# EAGLE design ccc_badge (EAGLE 5.10)
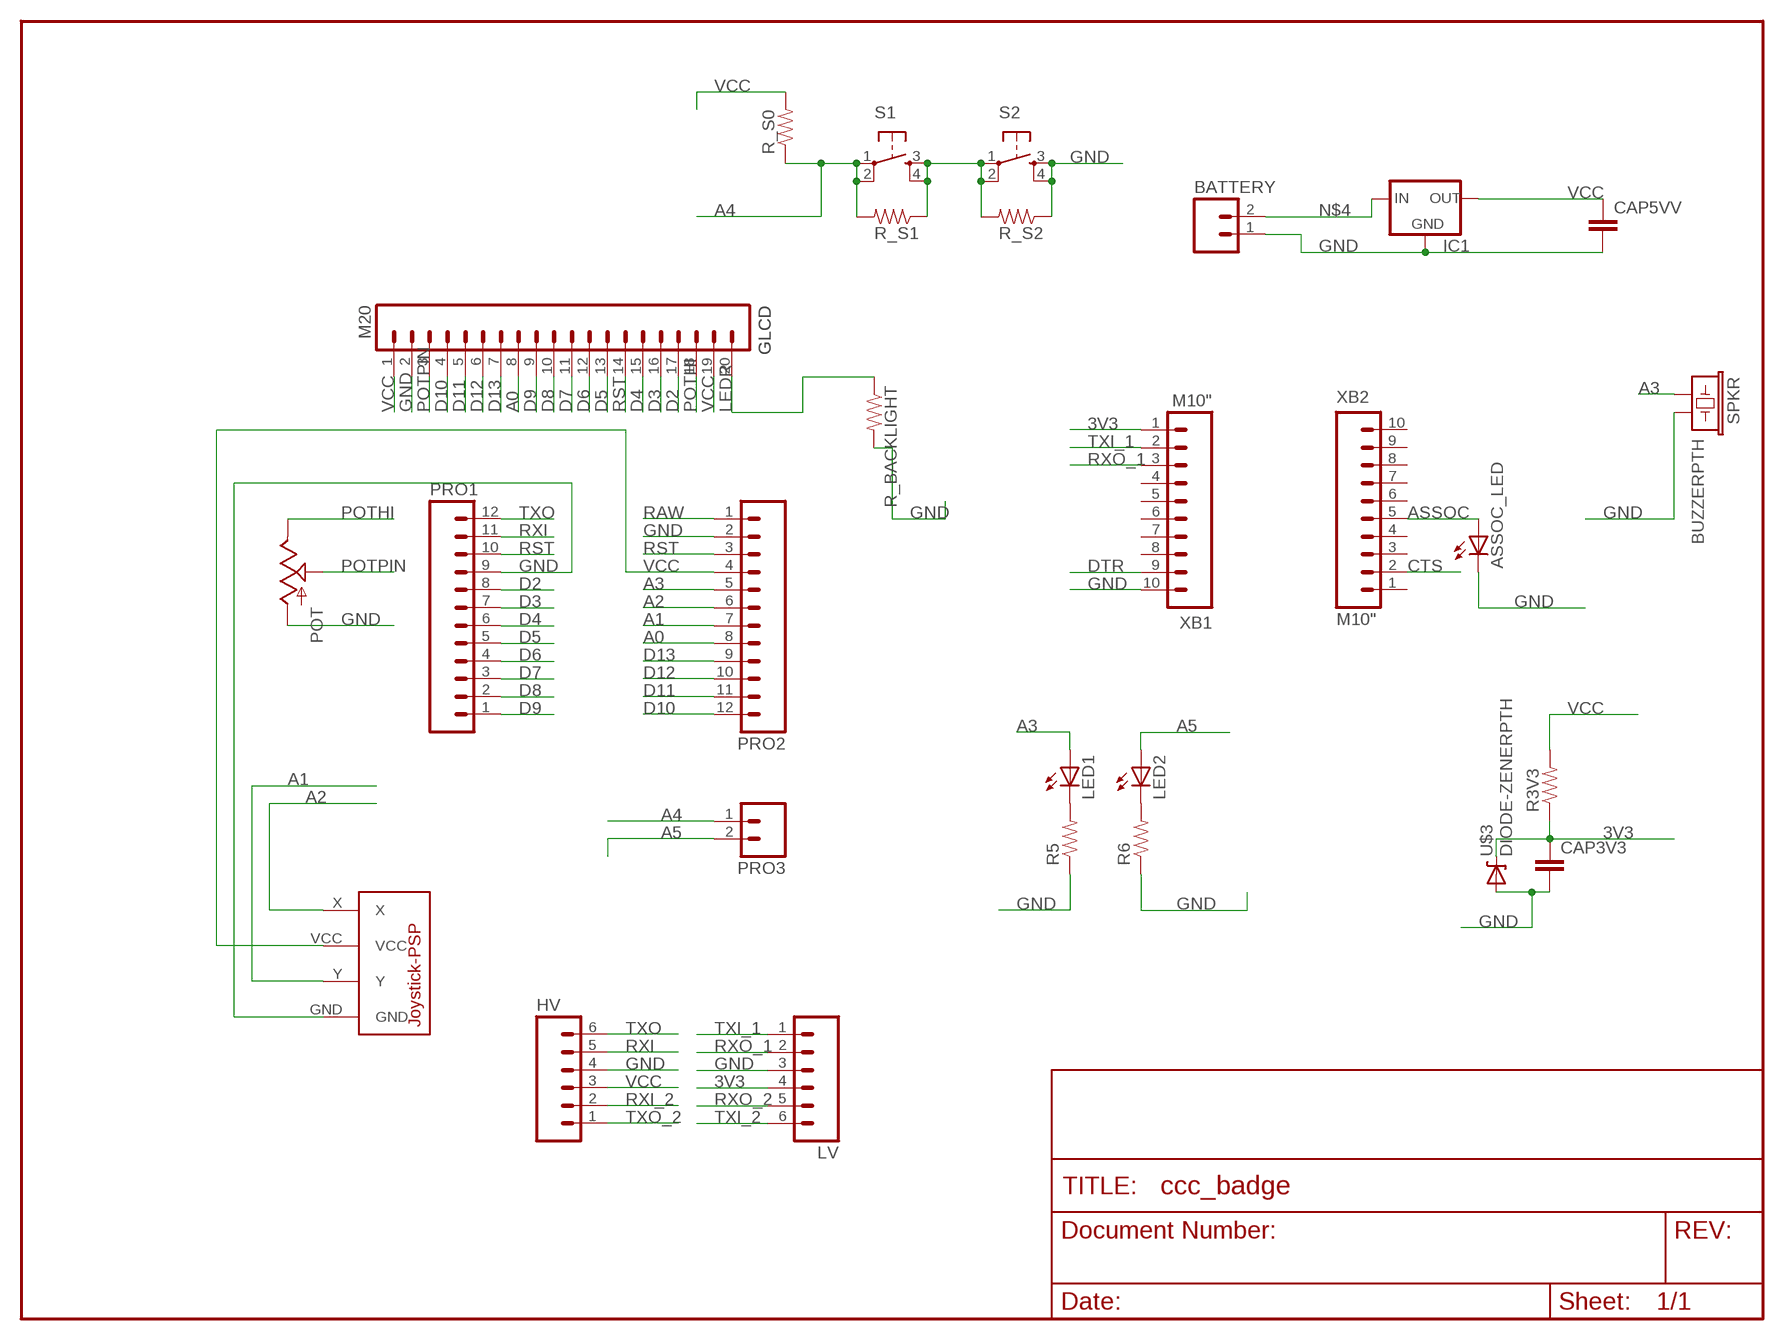
[diagram p0: schematic, sheet 1]

## Parts
ASSOC_LED  LED5MM  [LED5MM]
BATTERY  M02POLAR_LOCK  [MOLEX-1X2_LOCK]
CAP3V3  CAP_  [AXIAL-5MM]
CAP5VV  CAP_  [AXIAL-5MM]
GLCD  M20  [1X20]
HV  M06SIP  [1X06]
IC1  V_REG_78XXSIDE  [78XXL]
LED1  LED5MM  [LED5MM]
LED2  LED5MM  [LED5MM]
LV  M06SIP  [1X06]
POT  POT100K_3362U  [3362U]
PRO1  M12PTH  [1X12]
PRO2  M12PTH  [1X12]
PRO3  M02PTH  [1X02]
R3V3  RESISTORPTH1  [AXIAL-0.3]
R5  RESISTORPTH1  [AXIAL-0.3]
R6  RESISTORPTH1  [AXIAL-0.3]
R_BACKLIGHT  RESISTORPTH1  [AXIAL-0.3]
R_S0  RESISTORPTH1  [AXIAL-0.3]
R_S1  RESISTORPTH1  [AXIAL-0.3]
R_S2  RESISTORPTH1  [AXIAL-0.3]
S1  TAC_SWITCHPTH  [TACTILE-PTH]
S2  TAC_SWITCHPTH  [TACTILE-PTH]
SPKR  BUZZERPTH  [BUZZER-12MM]
U$1  JOYSTICK-PSP1000  [JOYSTICK-PSP1000]
U$3  DIODE-ZENERPTH  [DIODE-ZENER]
XB1  M10"  [1X10]
XB2  M10"  [1X10]

## Nets
3V3: CAP3V3.P$1 LV.4 R3V3.P$1 U$3.P$1(C) XB1.1
A0: GLCD.8 PRO2.8
A1: PRO2.7 U$1.Y
A2: PRO2.6 U$1.X
A3: LED1.A PRO2.5 SPKR.+
A4: PRO3.1 R_S0.P$1 R_S1.P$2 S1.1 S1.2
A5: LED2.A PRO3.2
ASSOC: ASSOC_LED.A XB2.5
CTS: XB2.2
D2: GLCD.17 PRO1.8
D3: GLCD.16 PRO1.7
D4: GLCD.15 PRO1.6
D5: GLCD.13 PRO1.5
D6: GLCD.12 PRO1.4
D7: GLCD.11 PRO1.3
D8: GLCD.10 PRO1.2
D9: GLCD.9 PRO1.1
D10: GLCD.4 PRO2.12
D11: GLCD.5 PRO2.11
D12: GLCD.6 PRO2.10
D13: GLCD.7 PRO2.9
DTR: XB1.9
GND [vcc]: ASSOC_LED.K(C) BATTERY.1 CAP3V3.P$2 CAP5VV.P$2 GLCD.2 HV.4 IC1.GND LV.3 POT.P$3(A) PRO1.9 PRO2.2 R5.P$1 R6.P$1 R_BACKLIGHT.P$2 R_S2.P$1 S2.3 S2.4 SPKR.- U$1.GND U$3.P$2(A) XB1.10
LEDR: GLCD.20 R_BACKLIGHT.P$1
N$2: R_S1.P$1 R_S2.P$2 S1.3 S1.4 S2.1 S2.2
N$4: BATTERY.2 IC1.IN
N$5: LED1.K(C) R5.P$2
N$6: LED2.K(C) R6.P$2
POTHI: GLCD.18 POT.P$1(E)
POTPIN: GLCD.3 POT.P$2(S)
RAW [vcc]: PRO2.1
RST: GLCD.14 PRO1.10 PRO2.3
RXI: HV.5 PRO1.11
RXI_2: HV.2
RXO_1: LV.2 XB1.3
RXO_2: LV.5
TXI_1: LV.1 XB1.2
TXI_2: LV.6
TXO: HV.6 PRO1.12
TXO_2: HV.1
VCC: CAP5VV.P$1 GLCD.1 GLCD.19 HV.3 IC1.OUT PRO2.4 R3V3.P$2 R_S0.P$2 U$1.VCC
Unconnected: XB1.4 XB1.5 XB1.6 XB1.7 XB1.8 XB2.1 XB2.3 XB2.4 XB2.6 XB2.7 XB2.8 XB2.9 XB2.10

## Library data of the parts
ASSOC_LED LED1 LED2 = SparkFun:LED: LEDs Standard schematic elements and footprints for 5mm, 3mm, 1206, and 0603 sized LEDs. 5mm - Spark Fun Electronics SKU : COM-00529 (and others)
BATTERY PRO3 = SparkFun:M02: Header 2 Standard 2-pin 0.1" header. Use with straight break away headers (SKU : PRT-00116), right angle break away headers (PRT-00553), swiss pins (PRT-00743), machine pins (PRT-00117), and female headers (PRT-00115). Molex polarized connector foot print use with SKU : PRT-08233 with associated crimp pins and housings.
CAP3V3 CAP5VV = SparkFun:CAP: Capacitor Standard 0603 ceramic capacitor, and 0.1" leaded capacitor.
GLCD = SparkFun:M20: This is just like the LOCK variant in that the holes are staggared by 5 mil, but except for the last two holes. They are not altered from the "standard" footprint layout. This is used for a special purpose on the layout of our Graphic LCD Backpack. Make sure you want to use this device before selecting it for you project!
HV LV = SparkFun:M06: Header 6 Standard 6-pin 0.1" header. Use with straight break away headers (SKU : PRT-00116), right angle break away headers (PRT-00553), swiss pins (PRT-00743), machine pins (PRT-00117), and female headers (PRT-00115). Molex polarized connector foot print use with SKU : PRT-08094 with associated crimp pins and housings. NOTES ON THE VARIANTS LOCK and LOCK_LONGPADS... This footprint was designed to help hold the alignment of a through-hole component (i.e. 6-pin header) while soldering it into place. You may notice that each hole has been shifted either up or down by 0.005 of an inch from it's more standard position (which is a perfectly straight line). This slight alteration caused the pins (the squares in the middle) to touch the edges of the holes. Because they are alternating, it causes a "brace" to hold the component in place. 0.005 has proven to be the perfect amount of "off-center" position when using our standard breakaway headers. Although looks a little odd when you look at the bare footprint, once you have a header in there, the alteration is very hard to notice. Also, if you push a header all the way into place, it is covered up entirely on the bottom side. This idea of altering the position of holes to aid alignment will be further integrated into the Sparkfun Library for other footprints. It can help hold any component with 3 or more connection pins.
IC1 = SparkFun:V_REG_78XX: Voltage Regulator Standard 7805 5V regulator. IGO (Input Ground Output). Spark Fun Electronics SKU : COM-00107
POT = SparkFun:POT
PRO1 PRO2 = SparkFun:M12: Header 12 Standard 12-pin 0.1" header. Use with straight break away headers (SKU : PRT-00116), right angle break away headers (PRT-00553), swiss pins (PRT-00743), machine pins (PRT-00117), and female headers (PRT-00115).
R3V3 R5 R6 R_BACKLIGHT R_S0 R_S1 R_S2 = SparkFun:RESISTOR: Resistor Basic schematic elements and footprints for 0603, 1206, and PTH 1/10th watt (small) resistors.
S1 S2 = SparkFun:TAC_SWITCH: Momentary Switch Button commonly used for reset or general input. Spark Fun Electronics SKU : COM-00097
SPKR = SparkFun:BUZZER: Buzzer 12mm Spark Fun Electronics SKU : Comp-Buzzer
U$1 = SparkFun:JOYSTICK-PSP1000: This is a footprint for the PSP-1000 Joystick. 4-pins: X, Y, Vcc and GND
U$3 = SparkFun:DIODE-ZENER: Zener Diode Production Part - 8199 3.4V Zener Voltage
XB1 XB2 = SparkFun:M10: Header 10 Standard 10-pin 0.1" header. Use with straight break away headers (SKU : PRT-00116), right angle break away headers (PRT-00553), swiss pins (PRT-00743), machine pins (PRT-00117), and female headers (PRT-00115).

## Net classes
0 default: width 0.203 mm
1 vcc: width 0.254 mm

## Board
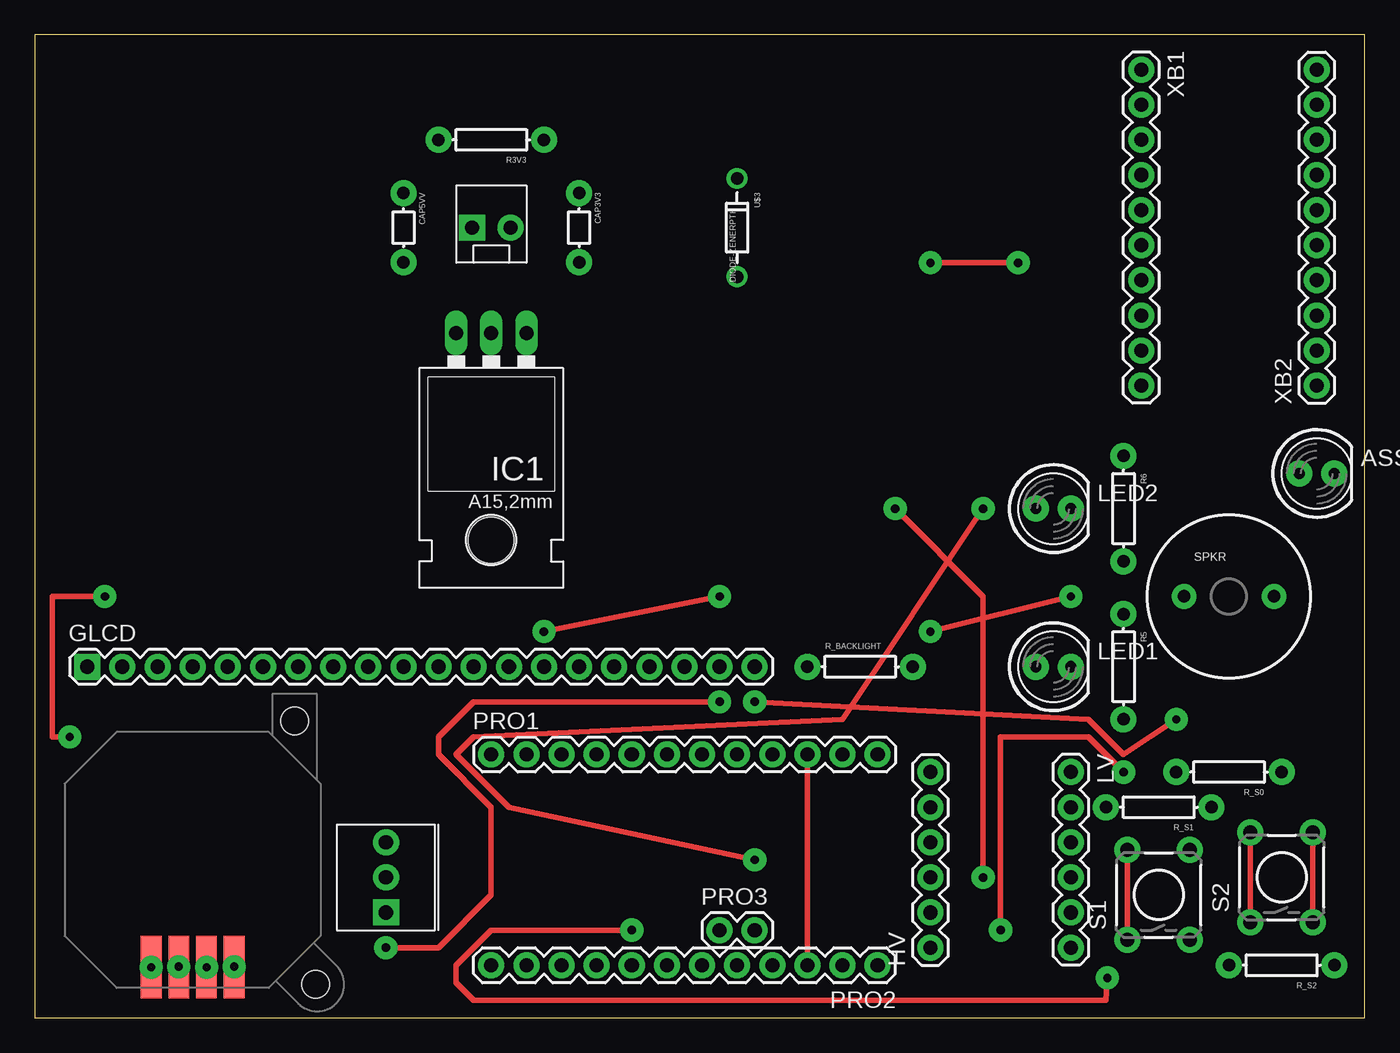
[diagram p1: board, top side]
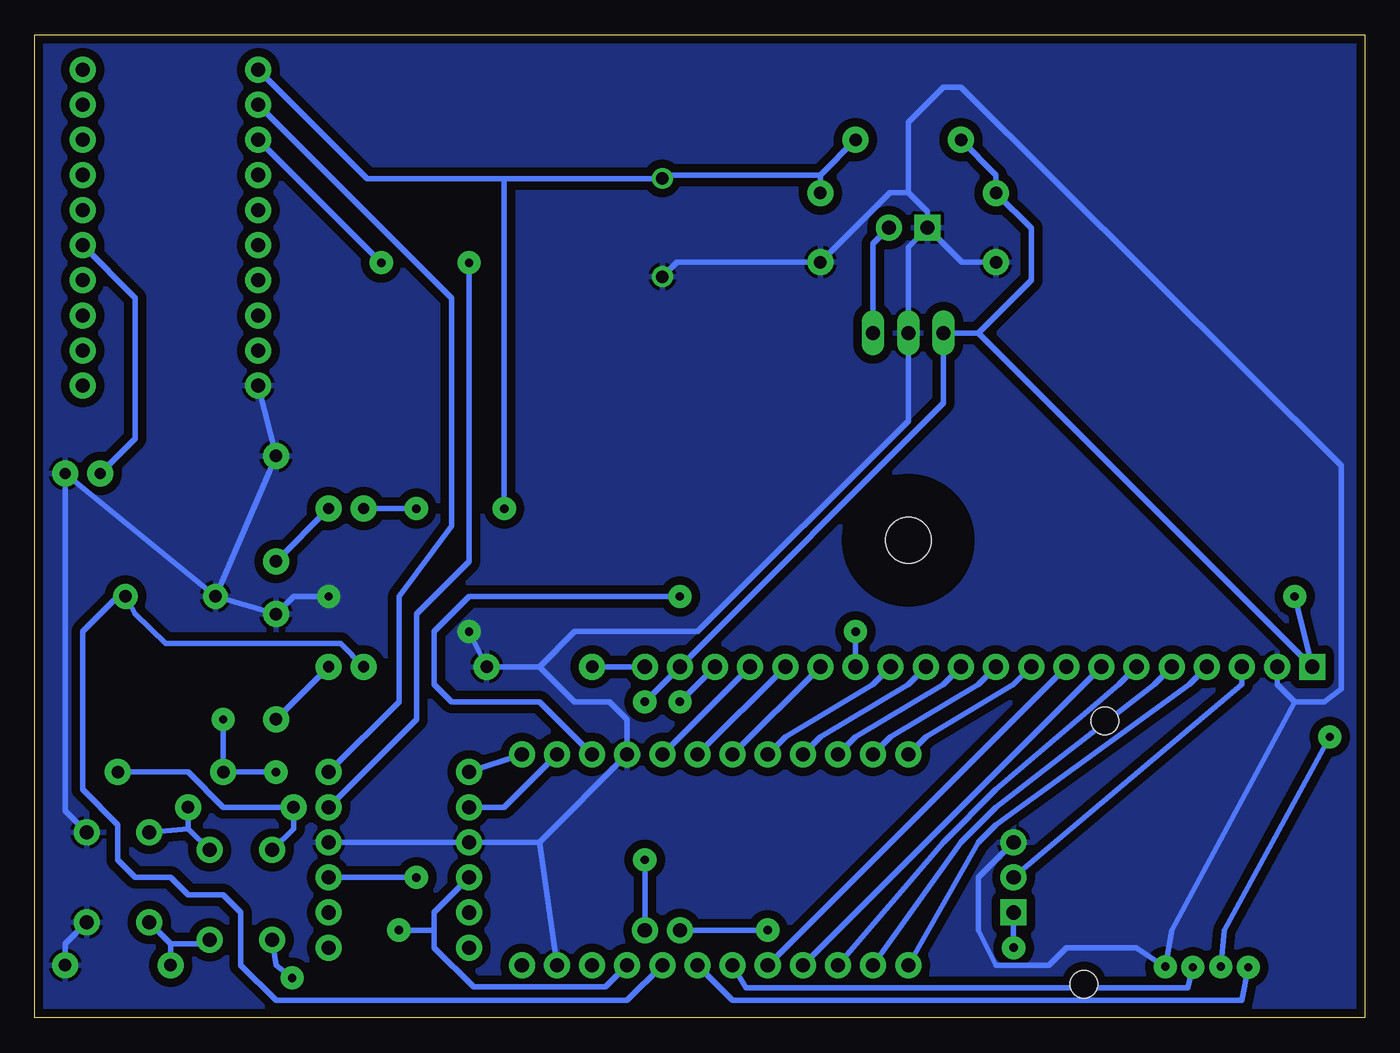
[diagram p2: board, bottom side, seen from below]

Size 96.19 x 71.11 mm. Coordinates in mm from the lower left corner, seen from the top.
Outline: 0,0 96.19,0 96.19,71.11 0,71.11 0,0
Copper layers (1*16): Top 0.035mm / dielectric 1.5mm / Bottom 0.035mm
Design rules "www.sparkfun.com tutorial Eagle-DFM SparkFun": minimum track width 8mil, minimum drill 20mil, track to track 8mil, track to pad 8mil, pad to pad 8mil, via to via 8mil, smd to smd 8mil, copper to edge 10mil, drill to drill 8mil, minimum pad ring 12mil, minimum via ring 10mil, stop-mask expansion 4mil, vias tented up to drill 25mil, thermal gap 10mil

### Footprints (pad centres in the part's own frame; a part is rotated, then mirrored left to right if it is on the bottom)
LED5MM = drill 0.813 pad 1.88 round: A -1.27,0; K 1.27,0
MOLEX-1X2_LOCK = drill 1.016 pad 1.88 square: 1 -0.127,0 | drill 1.016 pad 1.88 round: 2 2.667,0
AXIAL-5MM = drill 0.9 pad 1.88 round: P$1 -2.5,0; P$2 2.5,0
1X20 = drill 1.016 pad 1.88 square: 1 0,0 | drill 1.016 pad 1.88 round: 2 2.54,0; 3 5.08,0; 4 7.62,0; 5 10.16,0; 6 12.7,0; 7 15.24,0; 8 17.78,0; 9 20.32,0; 10 22.86,0; 11 25.4,0; 12 27.94,0; 13 30.48,0; 14 33.02,0; 15 35.56,0; 16 38.1,0; 17 40.64,0; 18 43.18,0; 19 45.72,0; 20 48.26,0
1X06 = drill 1.016 pad 1.88 round: 1 0,0; 2 2.54,0; 3 5.08,0; 4 7.62,0; 5 10.16,0; 6 12.7,0
78XXL = drill 1.016 long: GND 0,-3.81; IN -2.54,-3.81; OUT 2.54,-3.81 | hole 3.302: 0,11.176
3362U = drill 1.016 pad 1.88 square: P$1 0,2.54 | drill 1.016 pad 1.88 round: P$2 2.54,2.54; P$3 5.08,2.54
1X12 = drill 1.016 pad 1.88 round: 1 0,0; 2 2.54,0; 3 5.08,0; 4 7.62,0; 5 10.16,0; 6 12.7,0; 7 15.24,0; 8 17.78,0; 9 20.32,0; 10 22.86,0; 11 25.4,0; 12 27.94,0
1X02 = drill 1.016 pad 1.88 round: 1 0,0; 2 2.54,0
AXIAL-0.3 = drill 0.9 pad 1.88 round: P$1 -3.81,0; P$2 3.81,0
TACTILE-PTH = drill 1.016 pad 1.88 round: 1 -3.251,2.261; 2 3.251,2.261; 3 -3.251,-2.261; 4 3.251,-2.261
BUZZER-12MM = drill 0.9 pad 1.778 round: + 3.25,0; - -3.25,0
JOYSTICK-PSP1000 = smd 1.5 x 4.5: GND -3,7.75; VCC 1,7.75; X 3,7.75; Y -1,7.75 | hole 2: -8.89,8.985; -7.375,-10.06
DIODE-ZENER = drill 0.9 round: P$1 -3.556,0; P$2 3.556,0
1X10 = drill 1.016 pad 1.88 round: 1 0,0; 2 2.54,0; 3 5.08,0; 4 7.62,0; 5 10.16,0; 6 12.7,0; 7 15.24,0; 8 17.78,0; 9 20.32,0; 10 22.86,0

### Placement (x,y rotation side)
ASSOC_LED  92.71,39.37 0 top
BATTERY  31.75,57.15 0 top
CAP3V3  39.37,57.15 270 top
CAP5VV  26.67,57.15 270 top
GLCD  3.81,25.4 0 top
HV  64.77,5.08 90 top
IC1  33.02,45.72 180 top
LED1  73.66,25.4 0 top
LED2  73.66,36.83 0 top
LV  74.93,17.78 270 top
POT  27.94,7.62 90 top
PRO1  33.02,19.05 0 top
PRO2  60.96,3.81 180 top
PRO3  49.53,6.35 0 top
R3V3  33.02,63.5 180 top
R5  78.74,25.4 270 top
R6  78.74,36.83 270 top
R_BACKLIGHT  59.69,25.4 0 top
R_S0  86.36,17.78 180 top
R_S1  81.28,15.24 180 top
R_S2  90.17,3.81 180 top
S1  81.28,8.89 90 top
S2  90.17,10.16 90 top
SPKR  86.36,30.48 0 top
U$1  11.43,11.43 180 top
U$3  50.8,57.15 270 top
XB1  80.01,68.58 270 top
XB2  92.71,45.72 90 top

### Tracks (layer width: path | path; a pad name or v marks a point on that pad's centre or on a via)
3V3  (via drill 0.6 pad 1.68)
  Top 0.406: v68.58,10.16 68.58,30.48 v62.23,36.83
  Bottom 0.406: 39.37,60.96 CAP3V3.P$1 | 39.37,60.96 R3V3.P$1 | 39.37,60.96 50.55,60.96 U$3.P$1 62.23,60.71 | 62.23,60.71 72.14,60.71 XB1.1 | v68.58,10.16 LV.4 | v62.23,36.83 62.23,60.71
A0
  Bottom 0.406: GLCD.8 PRO2.8
A1  (1 unrouted)
  Bottom 0.406: PRO2.7 44.76,2.18 12.8,2.18 U$1.Y
A2  (1 unrouted)
  Bottom 0.406: PRO2.6 45.72,1.27 8.89,1.27 U$1.X
A3
  Bottom 0.406: PRO2.5 53.34,1.27 78.74,1.27 81.28,3.81 81.28,7.62 82.55,8.89 85.09,8.89 86.36,10.16 88.9,10.16 90.17,11.43 90.17,13.97 92.71,16.51 92.71,27.94 90.17,30.48 SPKR.+ 88.9,29.21 86.72,27.08 74.07,27.08 LED1.A
A4  (via drill 0.6 pad 1.68)
  Top 0.406: v43.18,6.35 33.02,6.35 30.48,3.81 30.48,2.54 31.75,1.27 77.47,1.27 v77.57,2.9 | S1.1 S1.2
  Bottom 0.406: S1.2 77.47,13.69 R_S1.P$2 82.55,15.24 85.09,17.78 R_S0.P$1 | v43.18,6.35 PRO3.1 | v77.57,2.9 78.74,3.81 S1.1
A5  (via drill 0.6 pad 1.68)
  Top 0.406: v68.58,36.83 58.42,21.59 31.75,20.32 30.48,19.05 34.29,15.24 v52.07,11.43
  Bottom 0.406: v68.58,36.83 LED2.A | v52.07,11.43 PRO3.2
ASSOC
  Bottom 0.406: ASSOC_LED.A 88.9,41.91 88.9,52.07 XB2.5
D2
  Bottom 0.406: GLCD.17 PRO1.8
D3
  Bottom 0.406: GLCD.16 PRO1.7
D4
  Bottom 0.406: GLCD.15 PRO1.6
D5
  Bottom 0.406: PRO1.5 41.91,20.32 35.56,24.13 GLCD.13
D6
  Bottom 0.406: PRO1.4 39.37,20.32 33.02,24.13 GLCD.12
D7
  Bottom 0.406: PRO1.3 36.83,20.32 30.48,24.13 GLCD.11
D8
  Bottom 0.406: PRO1.2 34.29,20.32 27.94,24.13 GLCD.10
D9
  Bottom 0.406: PRO1.1 31.75,20.32 25.4,24.13 GLCD.9
D10
  Bottom 0.406: PRO2.12 27.94,12.7 26.67,13.97 12.7,24.13 GLCD.4
D11
  Bottom 0.406: PRO2.11 29.21,12.7 26.67,15.24 15.24,24.13 GLCD.5
D12
  Bottom 0.406: PRO2.10 30.48,12.7 26.67,16.51 17.78,24.13 GLCD.6
D13
  Bottom 0.406: GLCD.7 PRO2.9
GND  (via drill 0.6 pad 1.68)  (1 unrouted)
  Top 0.406: v64.77,27.94 v74.93,30.48 | S2.4 S2.3
  Bottom 0.406: CAP5VV.P$2 29.12,54.65 BATTERY.1 | BATTERY.1 33.02,55.75 IC1.GND 33.02,43.18 48.26,27.94 57.15,27.94 59.69,25.4 | BATTERY.1 31.62,58.29 33.02,59.69 | 33.02,59.69 34.33,59.69 CAP3V3.P$2 49.74,54.65 U$3.P$2 | R_S2.P$1 93.98,5.36 S2.3 | GLCD.2 6.35,24.13 5.08,22.86 | 5.08,22.86 2.95,22.86 1.73,23.77 1.73,39.93 29.21,67.31 30.48,67.31 33.02,64.77 33.02,59.69 | POT.P$3 27.94,10.16 27.94,6.35 26.67,3.81 22.86,3.81 21.59,5.08 16.51,5.08 U$1.GND 13.97,6.35 5.08,22.86 | 59.69,25.4 57.15,22.86 54.61,22.86 53.34,21.59 PRO1.9 59.69,12.7 | SPKR.- R5.P$1 77.47,30.48 v74.93,30.48 | SPKR.- R6.P$1 XB1.10 | SPKR.- ASSOC_LED.K 93.98,14.96 S2.4 | 59.69,12.7 HV.4 LV.3 | 59.69,12.7 PRO2.2 | 59.69,25.4 R_BACKLIGHT.P$2 v64.77,27.94
  pour Bottom (isolate 0.61): 0,0 96.52,0 96.52,71.12 0,71.12
LEDR
  Bottom 0.406: GLCD.20 R_BACKLIGHT.P$1
N$1  (via drill 0.6 pad 1.68)
  other vias: 8.43,3.66
N$2
  Top 0.406: S2.1 S2.2
  Bottom 0.406: 86.36,5.36 R_S2.P$2 | 86.36,5.36 S2.1 | 85.09,13.69 R_S1.P$1 | 85.09,13.69 S1.4 | 86.36,5.36 83.82,5.36 S1.3 | S2.2 85.09,13.69
N$3  (via drill 0.6 pad 1.68)
  other vias: 10.41,3.71
N$4
  Bottom 0.406: IC1.IN 35.56,56.01 BATTERY.2
N$5
  Bottom 0.406: R5.P$2 LED1.K
N$6
  Bottom 0.406: LED2.K R6.P$2
N$7  (via drill 0.6 pad 1.68)
  other vias: 12.45,3.66
N$8  (via drill 0.6 pad 1.68)
  other vias: 14.43,3.71
POTHI  (via drill 0.6 pad 1.68)
  Top 0.406: v25.4,5.08 29.21,5.08 33.02,8.89 33.02,15.24 29.21,19.05 29.21,20.32 31.75,22.86 v49.53,22.86
  Bottom 0.406: v25.4,5.08 POT.P$1 | v49.53,22.86 GLCD.18
POTPIN
  Bottom 0.406: POT.P$2 8.89,24.13 GLCD.3
RST  (via drill 0.6 pad 1.68)
  Top 0.406: v49.53,30.48 v36.83,27.94 | PRO2.3 PRO1.10
  Bottom 0.406: PRO1.10 59.69,22.86 66.04,22.86 67.31,24.13 67.31,27.94 64.77,30.48 v49.53,30.48 | v36.83,27.94 GLCD.14
RXI
  Bottom 0.406: HV.5 62.23,15.24 PRO1.11
RXO_1  (via drill 0.6 pad 1.68)
  Top 0.406: v64.77,54.61 v71.12,54.61
  Bottom 0.406: LV.2 68.58,21.59 68.58,29.21 64.77,33.02 v64.77,54.61 | v71.12,54.61 XB1.3
TXI_1
  Bottom 0.406: XB1.2 66.04,52.07 66.04,35.56 69.85,30.48 69.85,22.86 LV.1
TXO
  Bottom 0.406: PRO1.12 HV.6
VCC  (via drill 0.6 pad 1.68)  (1 unrouted)
  Top 0.406: v5.08,30.48 1.27,30.48 1.27,20.32 v2.54,20.32 | v78.74,17.78 76.2,20.32 69.85,20.32 v69.85,6.35 | v52.07,22.86 76.2,21.59 78.74,19.05 v82.55,21.59
  Bottom 0.406: 27.94,49.53 IC1.OUT 30.48,44.45 GLCD.19 v52.07,22.86 | 27.94,49.53 24.13,53.34 24.13,57.11 CAP5VV.P$1 26.67,60.96 R3V3.P$2 | 27.94,49.53 GLCD.1 v5.08,30.48 | v2.54,20.32 10.16,6.35 U$1.VCC | PRO2.4 54.91,2.23 64.47,2.23 67.31,5.08 67.31,6.35 | 67.31,6.35 67.31,7.62 HV.3 | v78.74,17.78 R_S0.P$2 v82.55,21.59 | v69.85,6.35 67.31,6.35